# EAGLE schematic ToF-VL53L0X (EAGLE 8.5.2)
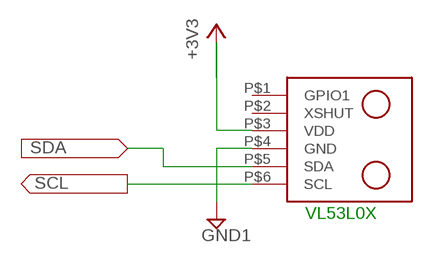
[diagram p0: schematic, sheet 1]

## Parts
U$1  VL53L0X  [VL53L0X]

## Nets
+3V3: U$1.P$3(VDD)
GND1: U$1.P$4(GND)
N$1: U$1.P$6(SCL)
N$2: U$1.P$5(SDA)
Unconnected: U$1.P$1(GPIO1) U$1.P$2(XSHUT)

## Notes on the sheet
- VL53L0X

## Library data of the parts
U$1 = getter-sensor:VL53L0X